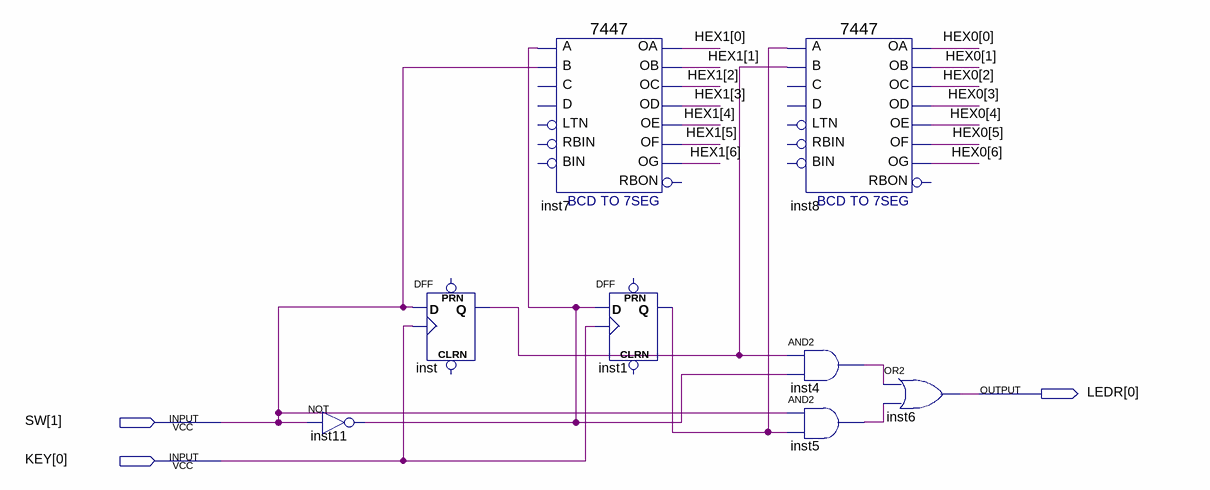
[diagram p0: schematic sheet]
// Quartus schematic LAB2_mealy.bdf as structural Verilog: 8 symbols, 3 pins
module LAB2_mealy (
  input  [1:1] SW,
  input  [0:0] KEY,
  output [0:0] LEDR
);

  wire inst1_q, inst4_out, inst5_out, inst11_out, inst_q;
  wire [6:0] HEX0, HEX1;

  not inst11 (inst11_out, SW[1]);
  DFF inst (.CLK(KEY[0]), .D(SW[1]), .Q(inst_q));  // open: CLRN, PRN
  \7447  inst7 (
    .B(SW[1]), .A(inst11_out), .OB(HEX1[1]), .OC(HEX1[2]), .OE(HEX1[4]), .OD(HEX1[3]), .OF(HEX1[5]),
    .OG(HEX1[6]), .OA(HEX1[0]));  // open: LTN, C, D, RBIN, BIN, RBON
  DFF inst1 (.CLK(KEY[0]), .D(inst11_out), .Q(inst1_q));  // open: CLRN, PRN
  \7447  inst8 (
    .B(inst_q), .A(inst1_q), .OB(HEX0[1]), .OC(HEX0[2]), .OE(HEX0[4]), .OD(HEX0[3]), .OF(HEX0[5]),
    .OG(HEX0[6]), .OA(HEX0[0]));  // open: LTN, C, D, RBIN, BIN, RBON
  and inst4 (inst4_out, inst_q, inst11_out);
  and inst5 (inst5_out, SW[1], inst1_q);
  or inst6 (LEDR[0], inst4_out, inst5_out);
endmodule
